# EAGLE schematic node (EAGLE 9.2.2)
CNAME: MNSLAC; CREVISION: 1.0; DESIGNER: 1961C - GT

## Sheet 1 of 3
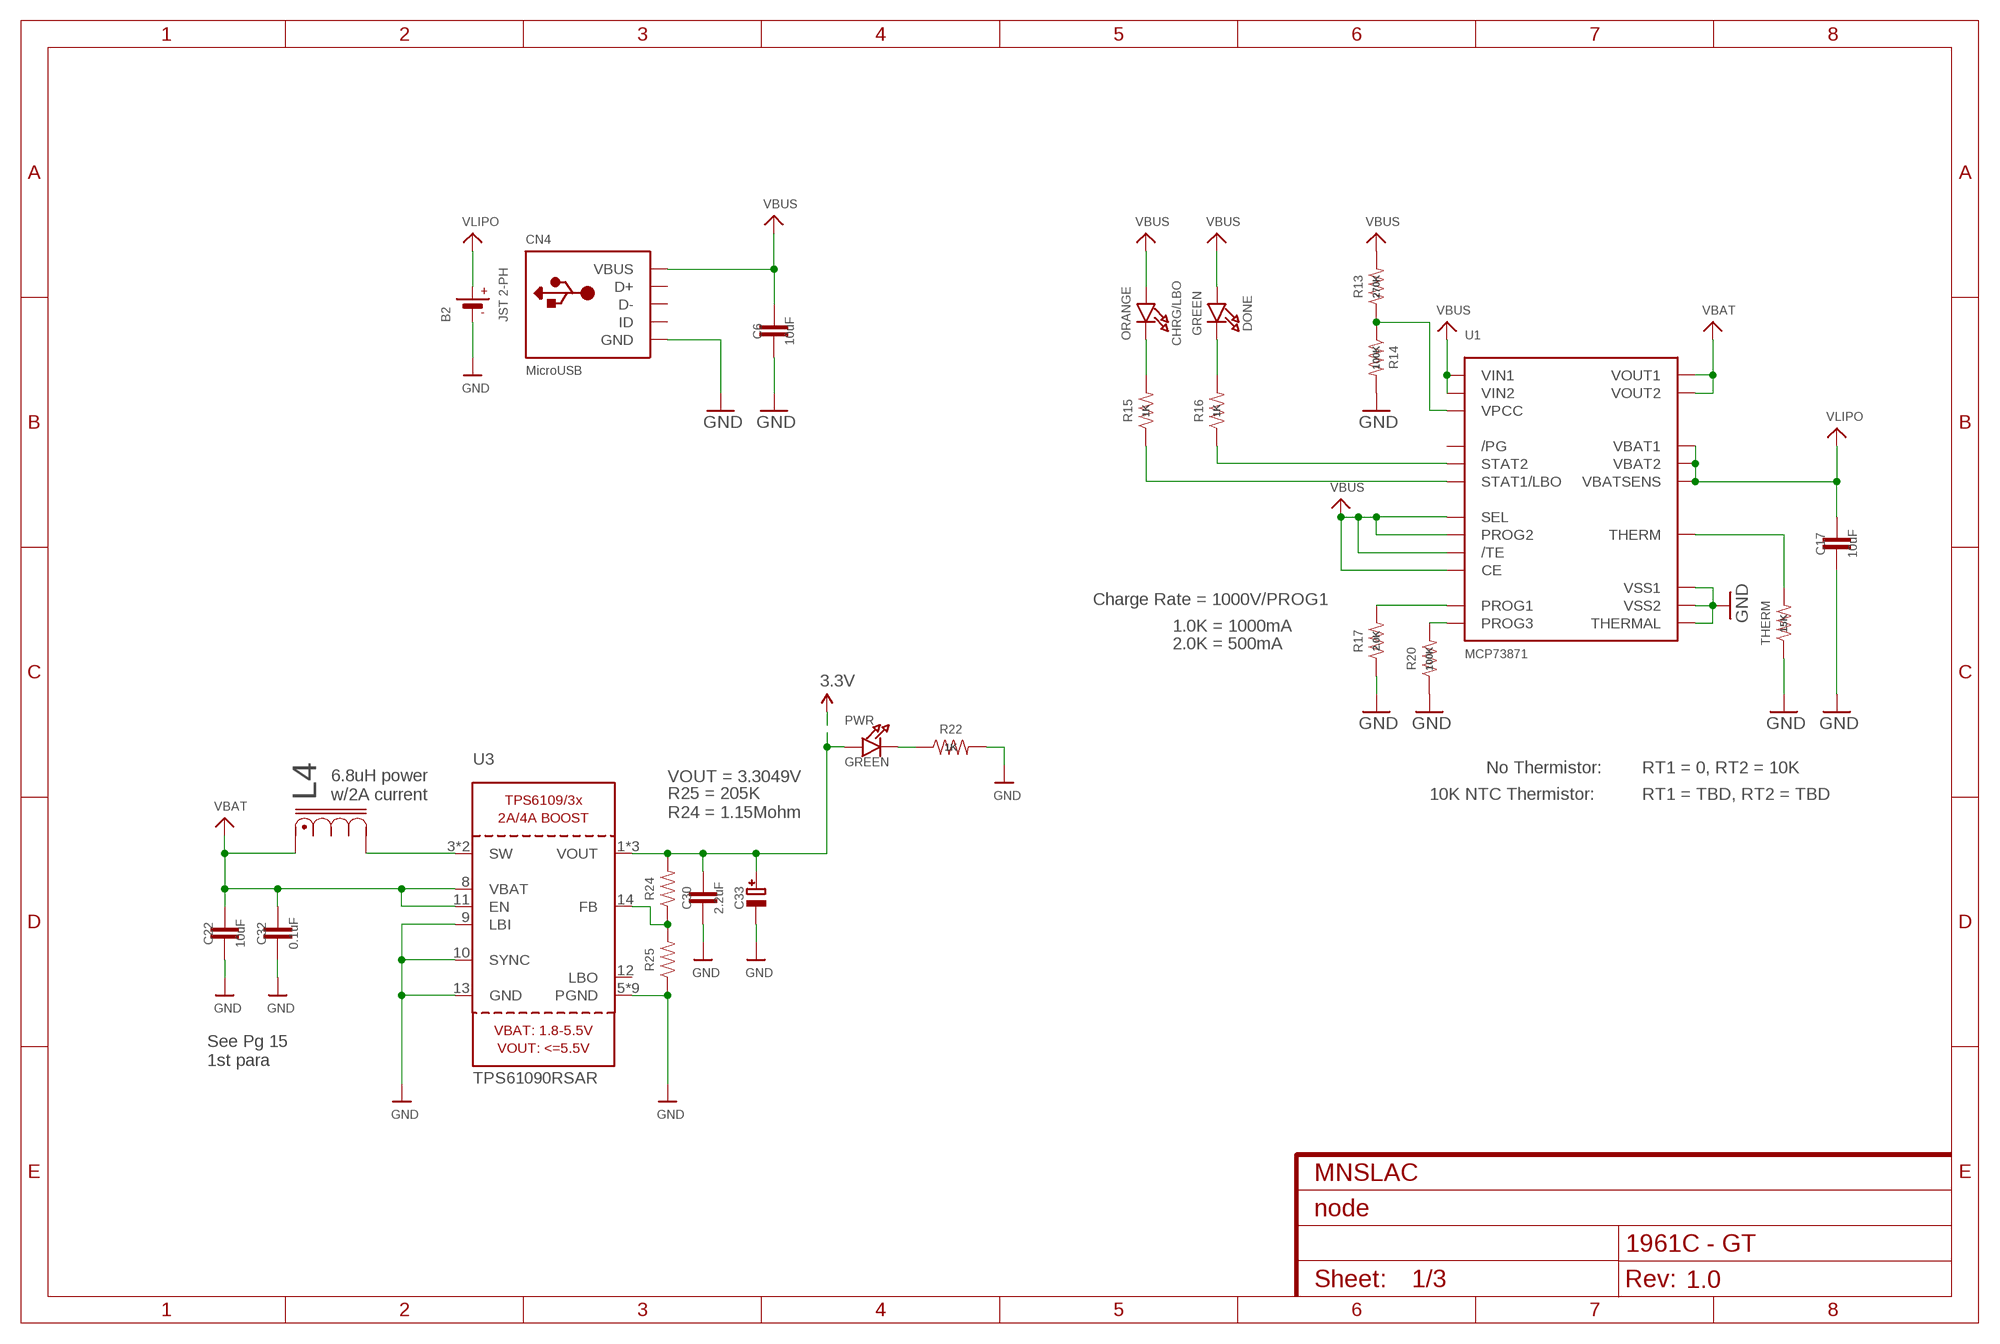
[diagram p0: schematic, sheet 1]

### Parts
B2  JST 2-PH  BATTERY  [JSTPH2]
C6  10uF  CAP0805  [0805]
C17  10uF  CAP0805  [0805]
C22  10uF  CAP0805  [0805]
C30  2.2uF  CAP0805  [0805]
C32  0.1uF  CAP0805  [0805]
C33  100uF/6V - https://www.digikey.com/product-detail/en/avx-corporation/F930G107MBA/478-8135-1-ND/4005827  CAP_TANTALUMB/3528_REFLOW  [EIA3528-21/B-R]
CHRG/LBO  ORANGE  LED0805_NOOUTLINE  [CHIPLED_0805_NOOUTLINE]
CN4  MicroUSB  USBMICRO_20329  [4UCONN_20329]
DONE  GREEN  LED0805_NOOUTLINE  [CHIPLED_0805_NOOUTLINE]
L4  https://www.digikey.com/product-detail/en/eaton-electronics-division/DR73-6R8-R/513-1134-1-ND/754632  DR73-6R8-R  [DR73]
PWR  GREEN  LED0805_NOOUTLINE  [CHIPLED_0805_NOOUTLINE]
R13  270K  RESISTOR0805-RES  [0805]
R14  100K  RESISTOR0805-RES  [0805]
R15  1K  RESISTOR0805-RES  [0805]
R16  1K  RESISTOR0805-RES  [0805]
R17  2.0K  RESISTOR0805-RES  [0805]
R20  100K  RESISTOR0805-RES  [0805]
R22  1K  RESISTOR0805-RES  [0805]
R24  1.15M  RESISTOR0805-RES  [0805]
R25  205K  RESISTOR0805-RES  [0805]
THERM  15K  RESISTOR0805-RES  [0805]
U1  MCP73871  [QFN20_4MM]
U3  TPS61090RSAR  VREG_TPS6103X  [PVQFN-16]

### Nets
3.3V: C30.1 C33.+ PWR.A R24.2 U3.1(VOUT) U3.15(VOUT) U3.16(VOUT) ; also sheet 2,3
GND: B2.1(-) C6.2 C17.2 C22.2 C30.2 C32.2 C33.- CN4.BASE@1(GND) CN4.BASE@2(GND) CN4.GND CN4.SPRT@1(GND) CN4.SPRT@2(GND) CN4.SPRT@3(GND) CN4.SPRT@4(GND) R14.2 R17.1 R20.1 R22.2 R25.1 THERM.1 U1.P$10(VSS1) U1.P$11(VSS2) U1.P$21(THERMAL) U3.5(PGND) U3.6(PGND) U3.7(PGND) U3.9(LBI) U3.10(SYNC) U3.13(GND) U3.P$18(PGND) U3.P$19(PGND) U3.P$20(PGND) U3.P$21(PGND) U3.P$22(PGND) U3.THERMAL(PGND) ; also sheet 2,3
N$8: R13.1 R14.1 U1.P$2(VPCC)
N$11: R16.1 U1.P$7(STAT2)
N$12: R15.1 U1.P$8(STAT1/LBO)
N$13: THERM.2 U1.P$5(THERM)
N$15: DONE.C R16.2
N$16: R17.2 U1.P$13(PROG1)
N$17: CHRG/LBO.C R15.2
N$18: R20.2 U1.P$12(PROG3)
N$20: L4.2 U3.3(SW) U3.4(SW)
N$22: PWR.C R22.1
N$23: R24.1 R25.2 U3.14(FB)
VBAT: C22.1 C32.1 L4.1 U1.P$1(VOUT1) U1.P$20(VOUT2) U3.8(VBAT) U3.11(EN)
VBUS: C6.1 CHRG/LBO.A CN4.VBUS DONE.A R13.2 U1.P$3(SEL) U1.P$4(PROG2) U1.P$9(/TE) U1.P$17(CE) U1.P$18(VIN1) U1.P$19(VIN2)
VLIPO: B2.2(+) C17.1 U1.P$14(VBAT1) U1.P$15(VBAT2) U1.P$16(VBATSENS)
Unconnected: CN4.D+ CN4.D- CN4.ID U1.P$6(/PG) U3.12(LBO)

### Notes on the sheet
- Charge Rate = 1000V/PROG1
- 1.0K = 1000mA
- 2.0K = 500mA
- No Thermistor: | RT1 = 0, RT2 = 10K
- VOUT = 3.3049V
- 6.8uH power
  w/2A current
- 10K NTC Thermistor: | RT1 = TBD, RT2 = TBD
- R25 = 205K
  R24 = 1.15Mohm
- See Pg 15
  1st para

## Sheet 2 of 3
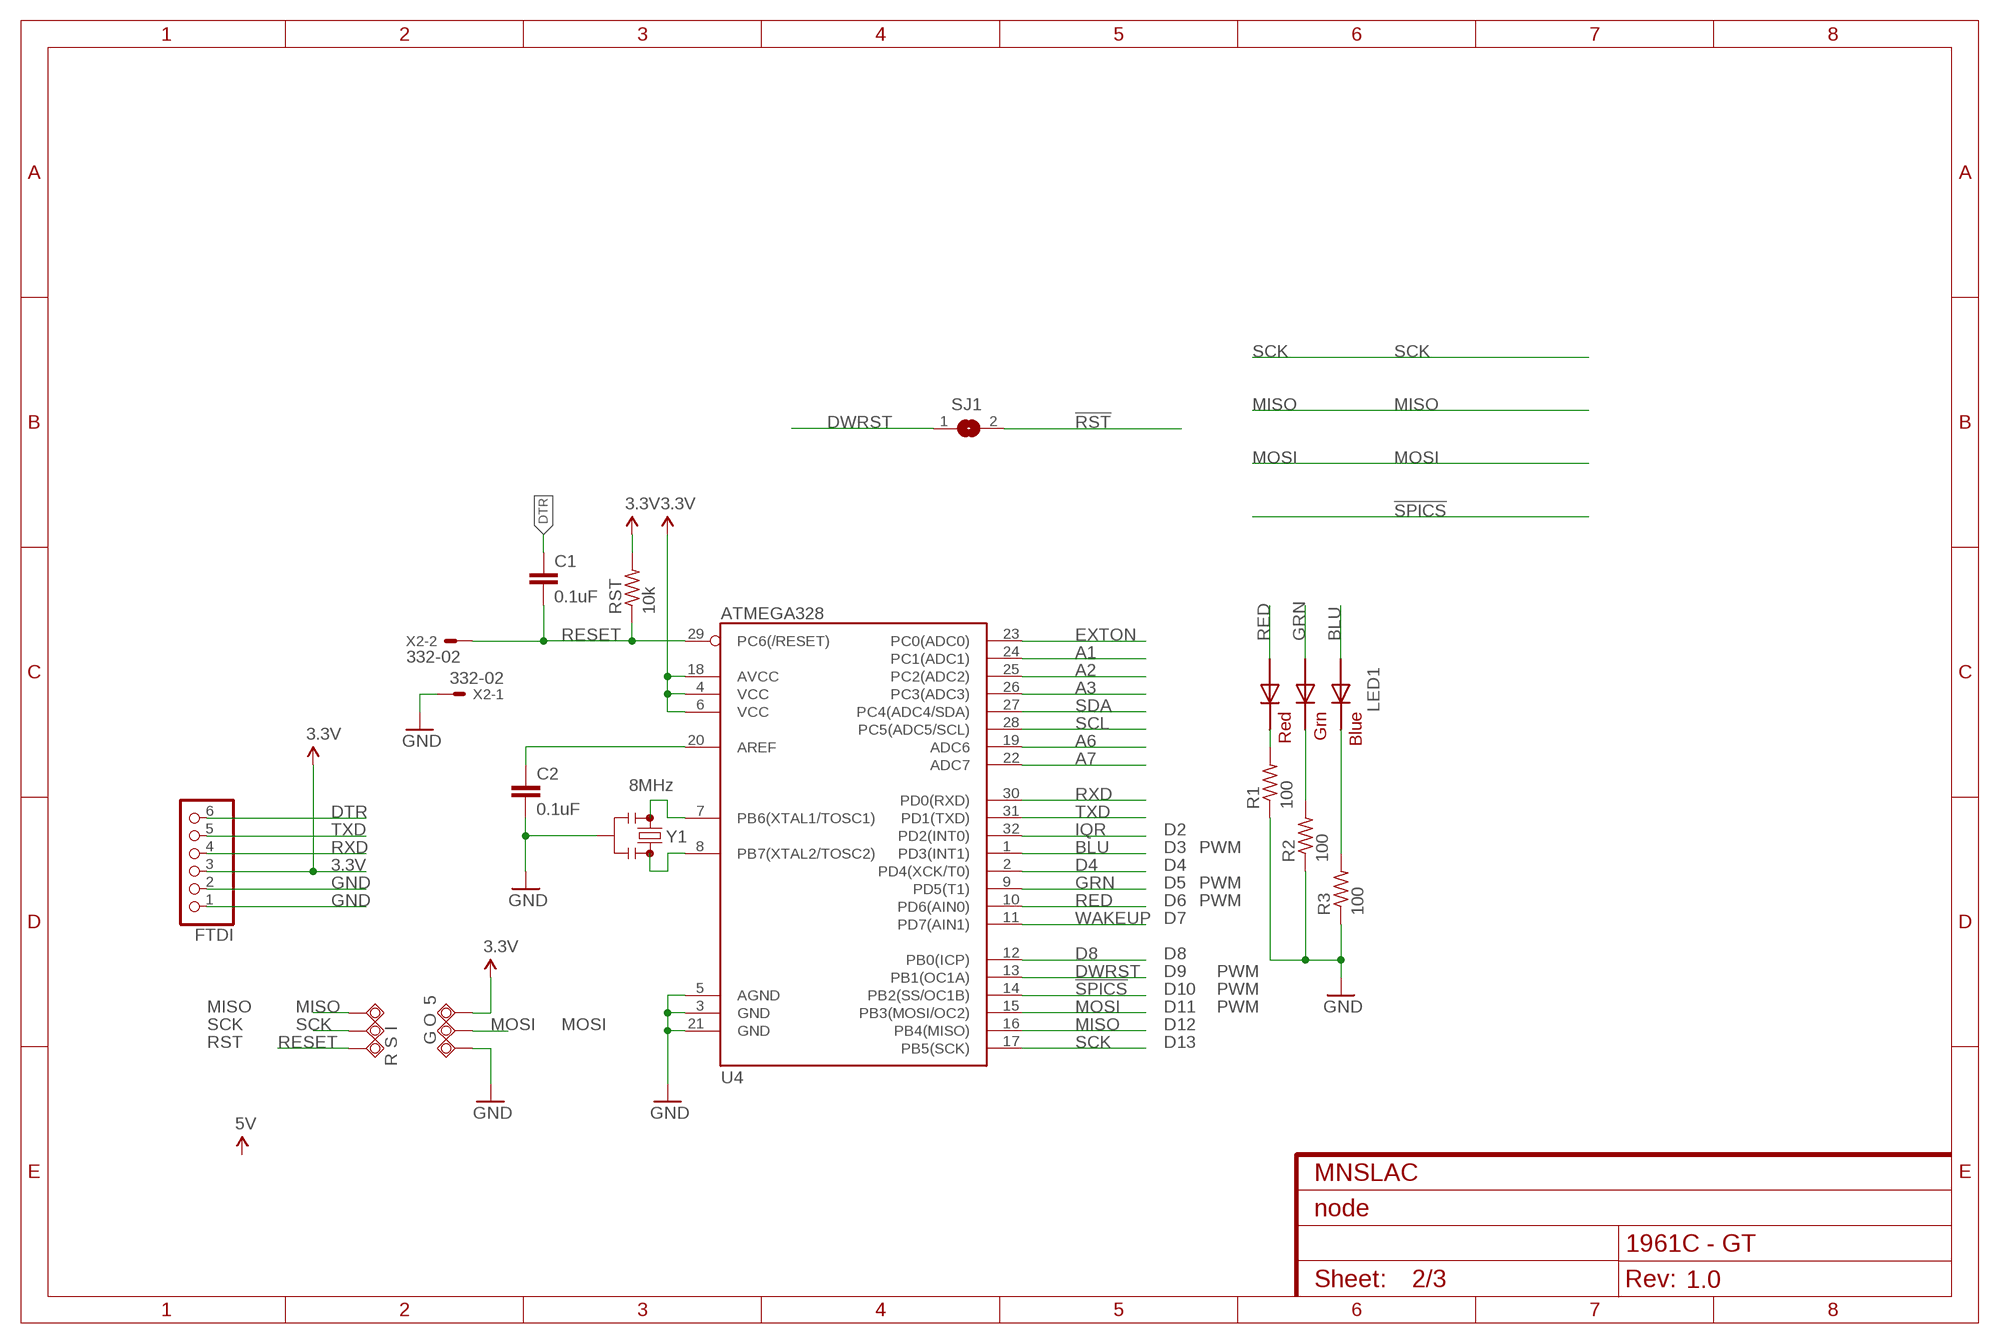
[diagram p1: schematic, sheet 2]

### Parts
5  TPSQTP08R  [TP08R]
C1  0.1uF  1.0UF-25V-+80/-20(0805)"  [0805-CAP]
C2  0.1uF  1.0UF-25V-+80/-20(0805)"  [0805-CAP]
FTDI  PINHD-1X6LOCK  [1X06-BIGLOCK]
G  TPSQTP08R  [TP08R]
I  TPSQTP08R  [TP08R]
LED1  RGBLED5050  [RGBLED5050]
O  TPSQTP08R  [TP08R]
R  TPSQTP08R  [TP08R]
R1  100  R-US_R0805  [R0805]
R2  100  R-US_R0805  [R0805]
R3  100  R-US_R0805  [R0805]
RST  10k  R-US_R0805  [R0805]
S  TPSQTP08R  [TP08R]
SJ1  SJ  [SJ]
U4  ATMEGA328  ATMEGA168  [TQFP32-08]
X2  332-02  [332-02]
Y1  8MHz  RESONATOR4MHZ  [RESONATOR-SMD_MED]

### Nets
3.3V: 5.TP FTDI.3 RST.2 U4.4(VCC) U4.6(VCC) U4.18(AVCC) ; also sheet 1,3
!RST: SJ1.2 ; also sheet 3
!SPICS: U4.14(PB2(SS/OC1B)) ; also sheet 3
A1: U4.24(PC1(ADC1))
A2: U4.25(PC2(ADC2))
A3: U4.26(PC3(ADC3))
A6: U4.19(ADC6)
A7: U4.22(ADC7)
AREF: C2.1 U4.20(AREF)
BLU: LED1.3(BLUE_A) U4.1(PD3(INT1))
D4: U4.2(PD4(XCK/T0))
D8: U4.12(PB0(ICP))
DTR: C1.1 FTDI.6
DWRST: SJ1.1 U4.13(PB1(OC1A))
EXTON: U4.23(PC0(ADC0)) ; also sheet 3
GND: C2.2 FTDI.1 FTDI.2 G.TP R1.1 R2.1 R3.1 U4.3(GND) U4.5(AGND) U4.21(GND) X2.1 Y1.2 ; also sheet 1,3
GRN: LED1.1(GREEN_A) U4.9(PD5(T1))
IQR: U4.32(PD2(INT0)) ; also sheet 3
MISO: I.TP U4.16(PB4(MISO)) ; also sheet 3
MOSI: O.TP U4.15(PB3(MOSI/OC2)) ; also sheet 3
N$1: U4.8(PB7(XTAL2/TOSC2)) Y1.3
N$2: LED1.5(RED_C) R1.2
N$3: LED1.6(GREEN_C) R2.2
N$4: LED1.4(BLUE_C) R3.2
N$9: U4.7(PB6(XTAL1/TOSC1)) Y1.1
RED: LED1.2(RED_A) U4.10(PD6(AIN0))
RESET: C1.2 R.TP RST.1 U4.29(PC6(/RESET)) X2.2
RXD: FTDI.4 U4.30(PD0(RXD))
SCK: S.TP U4.17(PB5(SCK)) ; also sheet 3
SCL: U4.28(PC5(ADC5/SCL))
SDA: U4.27(PC4(ADC4/SDA))
TXD: FTDI.5 U4.31(PD1(TXD))
WAKEUP: U4.11(PD7(AIN1)) ; also sheet 3

### Notes on the sheet
- D2
- D3 | PWM
- D4
- D5 | PWM
- D6 | PWM
- D7
- D8
- D9 | PWM
- D10 | PWM
- MISO | D11 | PWM
- SCK | MOSI | D12
- RST | D13

## Sheet 3 of 3
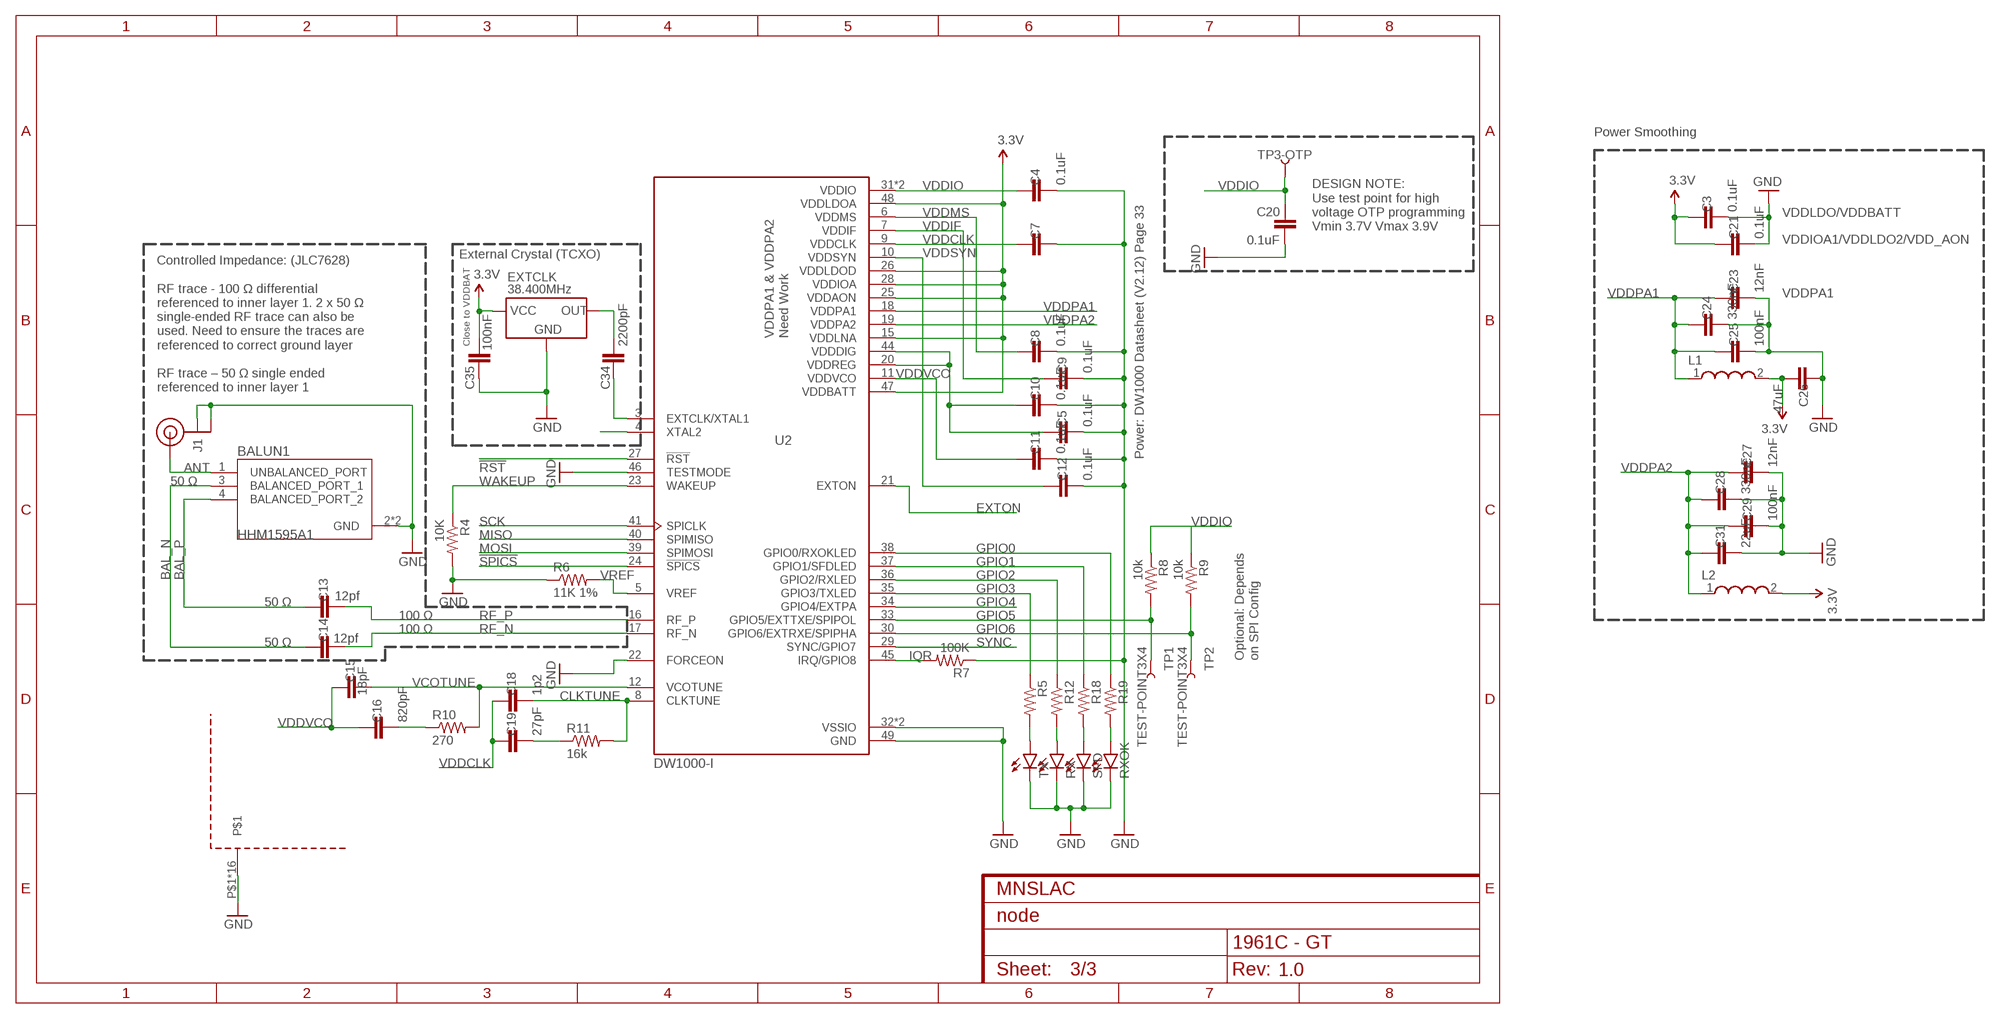
[diagram p2: schematic, sheet 3]

### Parts
BALUN1  HHM1595A1  [BALUN_HHM1595A1]
C3  0.1uF  CAP0402-CAP  [0402-CAP]
C4  0.1uF  CAP0402-CAP  [0402-CAP]
C5  0.1uF  CAP0402-CAP  [0402-CAP]
C7  0.1uF  CAP0402-CAP  [0402-CAP]
C8  0.1uF  CAP0402-CAP  [0402-CAP]
C9  0.1uF  CAP0402-CAP  [0402-CAP]
C10  0.1uF  CAP0402-CAP  [0402-CAP]
C11  0.1uF  CAP0402-CAP  [0402-CAP]
C12  0.1uF  CAP0402-CAP  [0402-CAP]
C13  12pf  CAP0402-CAP  [0402-CAP]
C14  12pf  CAP0402-CAP  [0402-CAP]
C15  18pF  CAP0402-CAP  [0402-CAP]
C16  820pF  CAP0402-CAP  [0402-CAP]
C18  1p2  CAP0402-CAP  [0402-CAP]
C19  27pF  CAP0402-CAP  [0402-CAP]
C20  0.1uF  CAP0402-CAP  [0402-CAP]
C21  0.1uF  CAP0402-CAP  [0402-CAP]
C23  12nF  CAP0402-CAP  [0402-CAP]
C24  330nF  CAP0402-CAP  [0402-CAP]
C25  100nF  CAP0402-CAP  [0402-CAP]
C26  47uF  CAP0402-CAP  [0402-CAP]
C27  12nF  CAP0402-CAP  [0402-CAP]
C28  330nF  CAP0402-CAP  [0402-CAP]
C29  100nF  CAP0402-CAP  [0402-CAP]
C31  22uF  CAP0402-CAP  [0402-CAP]
C34  2200pF  CAP0402-CAP  [0402-CAP]
C35  100nF  CAP0402-CAP  [0402-CAP]
EXTCLK  38.400MHz  ASTXR-12  [ASTXR-12]
J1  U.FL  ANTENNA_U.FL  [U.FL]
L1  BLM15AG601SN1D  WE-CBA_0402(HC)  [WE-CBA_0402(W=2.2)]
L2  BLM15AG601SN1D  WE-CBA_0402(HC)  [WE-CBA_0402(W=2.2)]
R4  10K  RESISTOR0402-RES  [0402-RES]
R5  470  RESISTOR0402-RES  [0402-RES]
R6  11K 1%  RESISTOR0402-RES  [0402-RES]
R7  100K  RESISTOR0402-RES  [0402-RES]
R8  10k  RESISTOR0402-RES  [0402-RES]
R9  10k  RESISTOR0402-RES  [0402-RES]
R10  270  RESISTOR0402-RES  [0402-RES]
R11  16k  RESISTOR0402-RES  [0402-RES]
R12  470  RESISTOR0402-RES  [0402-RES]
R18  470  RESISTOR0402-RES  [0402-RES]
R19  470  RESISTOR0402-RES  [0402-RES]
RX  LED0603  [LED-0603]
RXOK  LED0603  [LED-0603]
SFD  LED0603  [LED-0603]
TP1  TEST-POINT3X4  [PAD.03X.04]
TP2  TEST-POINT3X4  [PAD.03X.04]
TP3-OTP  TEST-POINT3X4  [PAD.03X.04]
TX  LED0603  [LED-0603]
U2  DW1000-I  [QFN40P600X600X90-49N]
U$6  SMS-255F  [SMS-255F]

### Nets
3.3V: C3.1 C21.1 C26.2 C35.2 EXTCLK.P$6(VCC) L1.2 L2.2 U2.15(VDDLNA) U2.25(VDDAON) U2.26(VDDLDOD) U2.28(VDDIOA) U2.47(VDDBATT) U2.48(VDDLDOA) ; also sheet 1,2
!RST: U2.27(!RST) ; also sheet 2
!SPICS: U2.24(!SPICS) ; also sheet 2
ANT [ant]: BALUN1.1(UNBALANCED_PORT) J1.3(SIGNAL)
BAL_N [single]: BALUN1.3(BALANCED_PORT_1) C14.1
BAL_P [single]: BALUN1.4(BALANCED_PORT_2) C13.1
CLKTUNE: C18.2 R11.2 U2.8(CLKTUNE)
EXTON: U2.21(EXTON) ; also sheet 2
GND: BALUN1.2(GND) BALUN1.5(GND) C3.2 C4.2 C5.2 C7.2 C8.2 C9.2 C10.2 C11.2 C12.2 C20.1 C21.2 C23.2 C24.2 C25.2 C26.1 C27.2 C28.2 C29.2 C31.2 C35.1 EXTCLK.P$1(GND) EXTCLK.P$3(GND) J1.1(GND) J1.2(GND) R4.2 R6.1 R7.1 RX.C RXOK.C SFD.C TX.C U2.22(FORCEON) U2.32(VSSIO) U2.43(VSSIO) U2.46(TESTMODE) U2.49(GND) U$6.P$1 U$6.P$2 U$6.P$3 U$6.P$4 U$6.P$5 U$6.P$6 U$6.P$7 U$6.P$8 U$6.P$9 U$6.P$10 U$6.P$11 U$6.P$12 U$6.P$13 U$6.P$14 U$6.P$15 U$6.P$16 ; also sheet 1,2
GPIO0: R19.1 U2.38(GPIO0/RXOKLED)
GPIO1: R18.1 U2.37(GPIO1/SFDLED)
GPIO2: R12.1 U2.36(GPIO2/RXLED)
GPIO3: R5.1 U2.35(GPIO3/TXLED)
GPIO4: U2.34(GPIO4/EXTPA)
GPIO5: R8.2 TP1.P$1 U2.33(GPIO5/EXTTXE/SPIPOL)
GPIO6: R9.2 TP2.P$1 U2.30(GPIO6/EXTRXE/SPIPHA)
IQR: R7.2 U2.45(IRQ/GPIO8) ; also sheet 2
MISO: U2.40(SPIMISO) ; also sheet 2
MOSI: U2.39(SPIMOSI) ; also sheet 2
N$5: R5.2 TX.A
N$6: R12.2 RX.A
N$7: C16.2 R10.1
N$10: C5.1 C10.1 U2.20(VDDREG) U2.44(VDDDIG)
N$14: C19.2 R11.1
N$21: R18.2 SFD.A
N$24: R19.2 RXOK.A
N$25: C34.1 U2.3(EXTCLK/XTAL1)
N$26: C34.2 EXTCLK.P$4(OUT)
N$27: U2.4(XTAL2)
RF_N [double]: C14.2 U2.17(RF_N)
RF_P [double]: C13.2 U2.16(RF_P)
SCK: U2.41(SPICLK) ; also sheet 2
SYNC: U2.29(SYNC/GPIO7)
VCOTUNE: C15.2 R10.2 U2.12(VCOTUNE)
VDDCLK: C7.1 C18.1 C19.1 U2.9(VDDCLK)
VDDIF: C9.1 U2.7(VDDIF)
VDDIO: C4.1 C20.2 R8.1 R9.1 TP3-OTP.P$1 U2.31(VDDIO) U2.42(VDDIO)
VDDMS: C8.1 U2.6(VDDMS)
VDDPA1: C23.1 C24.1 C25.1 L1.1 U2.18(VDDPA1)
VDDPA2: C27.1 C28.1 C29.1 C31.1 L2.1 U2.19(VDDPA2)
VDDSYN: C12.1 U2.10(VDDSYN)
VDDVCO: C11.1 C15.1 C16.1 U2.11(VDDVCO)
VREF: R6.2 U2.5(VREF)
WAKEUP: R4.1 U2.23(WAKEUP) ; also sheet 2

### Notes on the sheet
- Power Smoothing
- VDDLDO/VDDBATT
- DESIGN NOTE:
  Use test point for high
  voltage OTP programming
  Vmin 3.7V Vmax 3.9V
- VDDIOA1/VDDLDO2/VDD_AON
- External Crystal (TCXO)
- VDDPA1
- VDDPA1 & VDDPA2
  Need Work
- Close to VDDBAT
- Controlled Impedance: (JLC7628)
  
  RF trace - 100 Ω differential
  referenced to inner layer 1. 2 x 50 Ω
  single-ended RF trace can also be
  used. Need to ensure the traces are
  referenced to correct ground layer
  
  RF trace – 50 Ω single ended
  referenced to inner layer 1
- Power: DW1000 Datasheet (V2.12) Page 33
- 50 Ω
- 50 Ω
- 100 Ω
- 100 Ω
- 50 Ω
- Optional: Depends
  on SPI Config

## Library data of the parts
5 G I O R S = testpad:TPSQ: Test pad
B2 = microbuilder:BATTERY: CR1220 SMT - Digikey: 3001K-ND CD2032 BAT-HLD-001 - Digikey: BAT-HLD-001-ND
BALUN1 = MainLib:HHM1595A1: Baluns 50/100ohm, 3-8GHz Ultrawideband Balun; DESCRIPTION: Baluns 50/100ohm, 3-8GHz Ultrawideband Balun; DIGI-KEY_PART_NUMBER: 445-3387-1-ND; DIGI-KEY_PURCHASE_URL: https://www.digikey.com/product-detail/en/tdk-corporation/HHM1595A1/445-3387-1-ND/1641780?utm_source=snapeda&utm_medium=aggregator&utm_campaign=symbol; MF: TDK; MP: HHM1595A1; PACKAGE: 0805 TDK
C1 C2 = SparkFun-Capacitors:1.0UF-25V-+80/-20(0805): CAP-11625; PROD_ID: CAP-11625; VALUE: 1.0uF
C3-C32 C34 C35 = SparkFun-Passives:CAP: Capacitor Standard 0603 ceramic capacitor, and 0.1" leaded capacitor.
C33 = microbuilder:CAP_TANTALUM: Tantalum Capacitors Wave footprints have larger pads and are meant to be used for hand soldering. Reflow footprints are optimised for solder paste and a reflow oven. EIA3216-18/A-[R/W] - Size A / 3216-18 / 1206 footprint 4.7µF 25V 10% Tantalum Capacitor 10µF 16V 10% Tantalum Capacitor [Digikey: 495-2236-2-ND] EIA3528-21/B-[R/W] - Size B / 3528-21 47µF 10V 10% Tantalum Capactior [Digikey: 495-2216-1-ND] EIA6032-28/C-[R/W] - Size C / 6032-28 10µF 35V 20% Tantalum Capacitor [Digikey: 495-2285-1-ND] 100µF 16V 10% Tantalum Capactior [Digikey: 399-5214-1-ND]
CHRG/LBO DONE PWR = microbuilder:LED: LED 0603 - 0603 Surface Mount Package 2mA: Green LED - Low Power (3.9mcd, 2ma, 1.7Vf) - Digikey: 475-2709-2-ND Orange LED - Low Power (9.8mcd, 2ma, 1.8Vf) - Digikey: 475-1194-2-ND Red LED - Low Power (5mcd, 2ma, 1.8Vf) - Digikey: 475-1195-2-ND Yellow LED - Low Power (7mcd, 2ma, 1.8Vf) - Digikey: 475-1196-2-ND 5mA: Blue LED - Low Power (17mcd, 5ma, 2.9Vf) - Digikey: LNJ937W8CRACT-ND 0805 - 0805 Surface Mount Package 2mA: Red LED (8.8mcd, 2mA, 1.8Vf, Clear) - Low Power [Digikey: 475-2510-1-ND] Green LED (5mcd, 2mA, 1.8Vf, Clear) - Low Power [Digikey: 475-2730-1-ND] Yellow LED (11.3mcd, 2mA, 1.8Vf, Clear) - Low Power [Digikey: 475-2555-1-ND] 20mA: Red LED (104mcd, 20mA, Diffused) - LS R976 [Digikey: 475-1278-6-ND] Red LED (12mcd, 20mA, 2.0Vf, Clear) - APT2012EC [Digikey: 754-1128-1-ND] Green LED (15mcd, 20mA, 2.2Vf, Clear) - APT2012GC [Digikey: 754-1131-1-ND] Orange LED (160mcd, 20mA, 2.1Vf, Clear) - APT2012SECK [Digikey: 754-1130-1-ND] 1206 - 1206 Surface Mount Package Green LED (26mcd, 20mA, Diffused) - LG N971 [Digikey: 475-1407-6-ND] Red LED (15mcd, 20mA, Diffused) - LH N974 [Digikey: 475-1416-6-ND] Cree - Cree High-Power Surface Mount LEDs XPEBWT-L1-0000-00D50 - White 111lm 350mA 2.9Vf 6200K 110° XTEAWT-00-0000-00000LEE3 - White 114lm 350mA 2.85Vf 5000K 115° Everlight - Everlight 45-21 Series Surface Mount LEDs 45-21/QK2C-B2832AC2CB2/2T - Warm White 2000mcd 20mA 3.25Vf 3050K 120° 45-21/LK2C-B38452C4CB2/2T - Nuetral White 2000mcd 20mA 3.25Vf 4150K 120° 45-21/LK2C-B50634C6CB2/2T - Cold White 2200mcd 20mA 3.25Vf 5650K 120° PLCC2 Reverse Mount LS T77K-J1L2-1-0-2-R18-Z - Red 11.25mcd 2mA 1.8Vf 630nm 120° LO T77K-L1M2-24-Z - Orange 19.6mcd 2mA 1.8Vf 606nm 120° LY T77K-K2M1-26-Z - Yellow 15.7mcd 2mA 1.8Vf 587nm 120°
CN4 = microbuilder:USB: USB Connectors USBMINIB - Surface Mount Female Mini-B USB Connector 4UConnector: 06564
EXTCLK = MainLib:ASTXR-12: ASTXR-12-38.400MHz -514054 Temperature Compensated Oscillator https://www.digikey.com/product-detail/en/abracon-llc/ASTXR-12-38.400MHZ-514054-T/535-13192-1-ND/5719479
FTDI = adafruit:PINHD-1X6: PIN HEADER
J1 = adafruit:ANTENNA_U.FL: U.FL Antenna Connector
L1 L2 = Wurth_Elektronik_Passive_rev15e:WE-CBA: WE-CBA SMD EMI Suppression Ferrite Bead Characteristics Reliable Ni-Sn electrodes High rated current up to 5A Recommended soldering: Reflow Operating temperature: -55°C to +125°C Applications * Perfect as data line filter and for uncoupling of distribution voltage *This special SMD chip bead ferrites can be put directly on the printed circuit board. They offer excellent anti-EMI properties and low DC-resistance. Placed very close next to the interference source even with smallest size 0402,maximal impedance at 1000 Ω can be reached. *High Speed: "High Speed " SMD ferrites WE-CBF have lower impedance in the lower frequency ranges thus they have only a low attenuation for fast signals. Application e.g. USB 2.0, IEEE 1394,LVDS *Wide Band: "Wide Band" SMD ferrites WE-CBF already show high impedance in low frequency range. Therefore they are wide band through the whole spectrum. Application e.g. control signats, RS232, RS422, DC/DC converter *High Current: "High Current " SMD ferrites WE-CBF are designed for high current (over 1 A). The rated current refers to 40K self-heating. High current SMD ferrites are available in all there types (High Speed, Wide Band and High Frequency). Application e.g. power supply, DC/DC converter *Advice: Pay attention for the use of SMD-Ferrites for high current>1A and ambient temperature over +85°C that the rated current has to be reduced when temperature is above +85°C (Derating). *At+100°C environment temperature the maximal rated current has to add up to only 60% of the data sheet value ,without an overload of the component. Variant abbreviation WB means WIDE BAND HS means HIGH SPEED HC means HIGH CURRENT <http://katalog.we-online.de/media/images/eisos/FeCBA_pf2.jpg> Details see: http://katalog.we-online.de/en/pbs/WE-CBA/ Created: 2015-02-02 2015 (C) Wurth Elektronik
L4 = MainLib:DR73-6R8-R; MANUFACTURER_PART_NUMBER: DR736R8R; VENDOR: Cooper Bussmann
LED1 = adafruit:RGBLED: For 5050 RGB LEDs, the order of the LEDs may vary from one manufacturer to another!
R1-R3 RST = resistor:R-US_: RESISTOR, American symbol
R4-R20 R22 R24 R25 THERM = SparkFun-Passives:RESISTOR: Resistor Basic schematic elements and footprints for 0603, 1206, and PTH resistors.
RX RXOK SFD TX = SparkFun-LED:LED: LEDs Standard schematic elements and footprints for 5mm, 3mm, 1206, and 0603 sized LEDs. 5mm - Spark Fun Electronics SKU : COM-00529 (and others)
SJ1 = jumper:SJ: SMD solder JUMPER
TP1 TP2 TP3-OTP = SparkFun-Passives:TEST-POINT: Bare copper test points for troubleshooting or ICT
U1 = microbuilder:MCP73871: MCP73871 Lithium Polymer Battery Charger Digikey: MCP73871-2CCI/ML-ND
U2 = MainLib:DW1000-I: The DW1000 is a fully integrated single chip Ultra Wideband (UWB) low-power low-cost transceiver IC compliant to IEEE802.15.4-2011. It can be used in 2-way ranging or TDOA location systems to locate assets to a precision of 10 cm. It also supports data transfer at rates up to 6.8 Mbps; AVAILABILITY: Unavailable; DESCRIPTION: Ic Rf Txrx 802.15.4 48-Qfn; MF: Decawave Limited; MP: DW1000-I; PACKAGE: QFN-48 Decawave; PRICE: None
U3 = microbuilder:VREG_TPS6103X: TPS6103x 4A Boost - 1.8-5.5V Input, Adjustable Output to 5.5V
U4 = SparkFun:ATMEGA168
U$6 = MainLib:SMS-255F: https://www.digikey.com/product-detail/en/leader-tech-inc/SMS-255F/1798-1199-1-ND/7203579
X2 = con-garry:332-02: 2 Pin - 2mm Dual Row Source: www.mpe-connector.de / garry_shortform_2012.pdf
Y1 = SparkFun-FreqCtrl:RESONATOR: Resonator Small SMD resonator. Used, eg, on the Arduino Pro/ Pro Mini boards. 8MHz- XTAL-08895 16MHz- XTAL-08900; PROD_ID: XTAL-12492; VALUE: 4MHz

## Net classes
1 single: width 0.293 mm, clearance 0.203 mm
2 double: width 0.192 mm, clearance 0.178 mm
3 ant: width 0.235 mm, clearance 0.203 mm